# EAGLE schematic uno_shield_generic_1 (EAGLE 7.5.0)
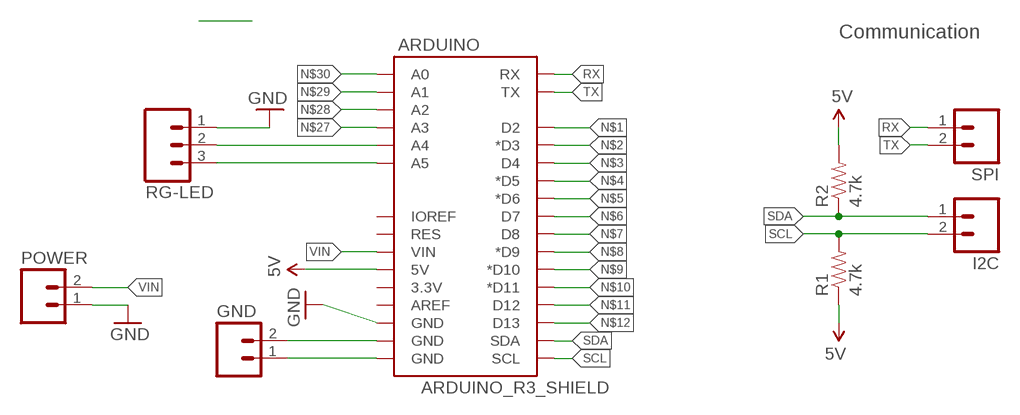
[diagram p0: schematic, sheet 1]

## Parts
ARDUINO  ARDUINO_R3_SHIELD  [UNO_R3_SHIELD]
GND  M02LOCK_LONGPADS  [1X02_LOCK_LONGPADS]
I2C  M02LOCK_LONGPADS  [1X02_LOCK_LONGPADS]
POWER  M02LOCK_LONGPADS  [1X02_LOCK_LONGPADS]
R1  4.7k  RESISTORKIT  [AXIAL-0.3-KIT]
R2  4.7k  RESISTORKIT  [AXIAL-0.3-KIT]
RG-LED  M03LONGPADS  [1X03_LONGPADS]
SPI  M02LOCK_LONGPADS  [1X02_LOCK_LONGPADS]

## Nets
5V: ARDUINO.5V R1.P$1 R2.P$2
GND: ARDUINO.GND@2(GND) POWER.1 RG-LED.1
N$1: ARDUINO.D2
N$2: ARDUINO.D3(*D3)
N$3: ARDUINO.D4
N$4: ARDUINO.D5(*D5)
N$5: ARDUINO.D6(*D6)
N$6: ARDUINO.D7
N$7: ARDUINO.D8
N$8: ARDUINO.D9(*D9)
N$9: ARDUINO.D10(*D10)
N$10: ARDUINO.D11(*D11)
N$11: ARDUINO.D12
N$12: ARDUINO.D13
N$17: ARDUINO.A4 RG-LED.2
N$18: ARDUINO.A5 RG-LED.3
N$21: ARDUINO.GND@1(GND) GND.2
N$22: ARDUINO.GND@0(GND) GND.1
N$27: ARDUINO.A3
N$28: ARDUINO.A2
N$29: ARDUINO.A1
N$30: ARDUINO.A0
RX: ARDUINO.RX SPI.1
SCL: ARDUINO.SCL I2C.2 R1.P$2
SDA: ARDUINO.SDA I2C.1 R2.P$1
TX: ARDUINO.TX SPI.2
VIN: ARDUINO.VIN POWER.2
Unconnected: ARDUINO.3.3V ARDUINO.AREF ARDUINO.IOREF ARDUINO.RES

## Notes on the sheet
- Communication

## Library data of the parts
ARDUINO = Nathans-Arduinos:ARDUINO_R3_SHIELD: Shield form compatible with the Arduino Uno R3.
GND I2C POWER SPI = SparkFun-Connectors:M02: Standard 2-pin 0.1" header. Use with - straight break away headers ( PRT-00116) - right angle break away headers (PRT-00553) - swiss pins (PRT-00743) - machine pins (PRT-00117) - female headers (PRT-00115) Molex polarized connector foot print use with: PRT-08233 with associated crimp pins and housings. 2.54_SCREWTERM for use with PRT-10571. 3.5mm Screw Terminal footprints for PRT-08084 5mm Screw Terminal footprints for use with PRT-08432
R1 R2 = SparkFun-Resistors:RESISTOR: Resistor Basic schematic elements and footprints for 0603, 1206, and PTH resistors.
RG-LED = SparkFun-Connectors:M03: Header 3 Standard 3-pin 0.1" header. Use with straight break away headers (SKU : PRT-00116), right angle break away headers (PRT-00553), swiss pins (PRT-00743), machine pins (PRT-00117), and female headers (PRT-00115). Molex polarized connector foot print use with SKU : PRT-08232 with associated crimp pins and housings.